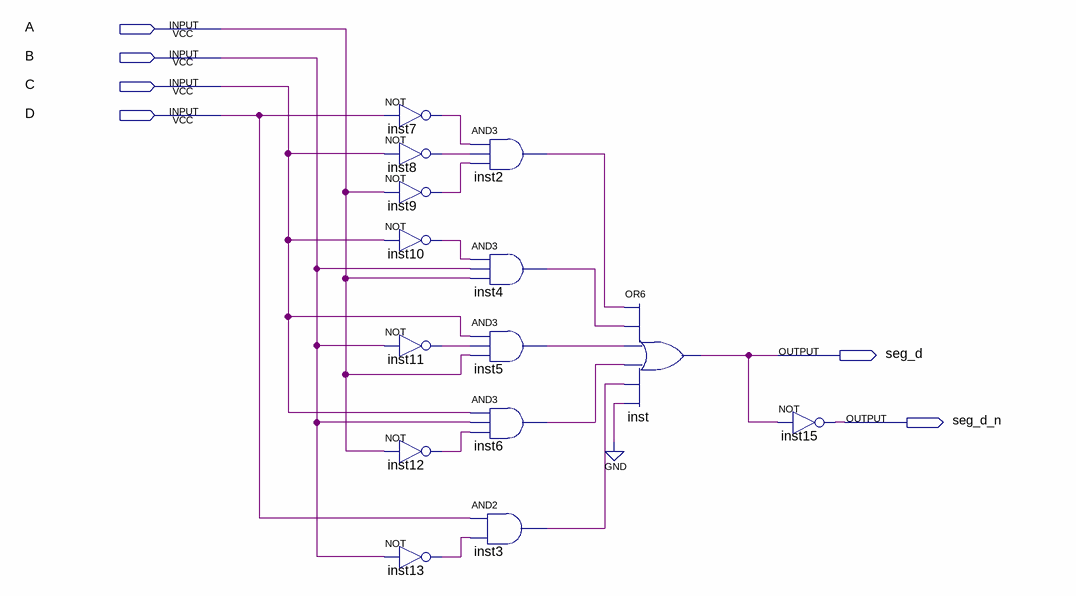
[diagram p0: schematic sheet]
// Quartus schematic segmento_d.bdf as structural Verilog: 14 symbols, 6 pins
module segmento_d (
  input  A,
  input  B,
  input  C,
  input  D,
  output seg_d,
  output seg_d_n
);

  wire inst2_out, inst3_out, inst4_out, inst5_out, inst6_out, inst7_out, inst8_out, inst9_out, inst10_out,
       inst11_out, inst12_out, inst13_out;

  not inst7 (inst7_out, D);
  not inst8 (inst8_out, C);
  not inst9 (inst9_out, A);
  not inst10 (inst10_out, C);
  not inst11 (inst11_out, B);
  not inst12 (inst12_out, A);
  not inst13 (inst13_out, B);
  and inst2 (inst2_out, inst7_out, inst8_out, inst9_out);
  and inst4 (inst4_out, inst10_out, B, A);
  and inst5 (inst5_out, C, inst11_out, A);
  and inst6 (inst6_out, C, B, inst12_out);
  and inst3 (inst3_out, D, inst13_out);
  or inst (seg_d, inst2_out, inst4_out, inst5_out, inst6_out, inst3_out, 1'b0);
  not inst15 (seg_d_n, seg_d);
endmodule
